# EAGLE design temp-stellwerk-laser-4-left (EAGLE 9.6.2)
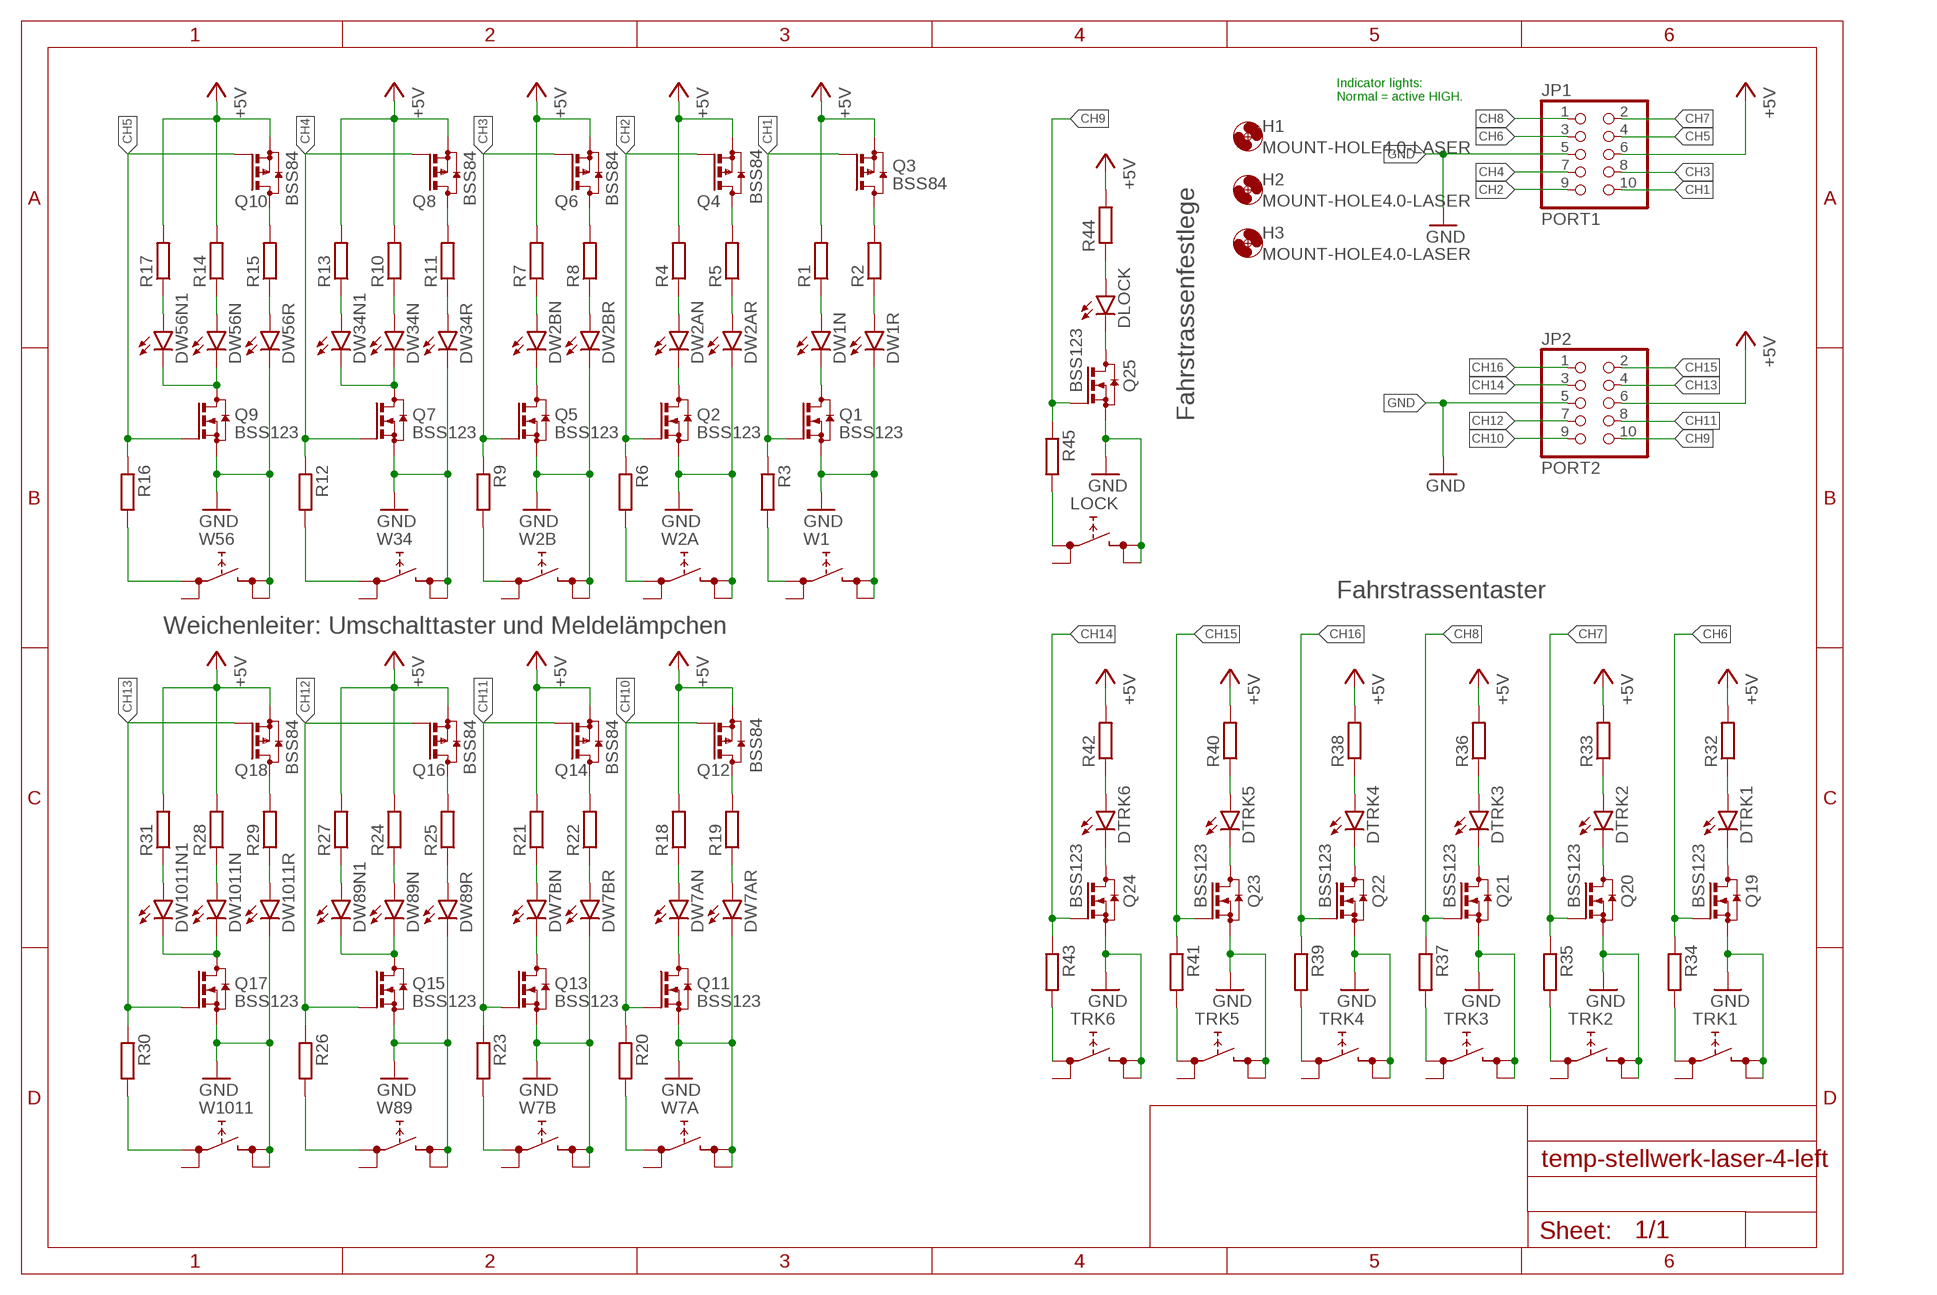
[diagram p0: schematic, sheet 1]

## Parts
DLOCK  LEDCHIPLED_0805  [CHIPLED_0805]
DTRK1  LEDCHIPLED_0805  [CHIPLED_0805]
DTRK2  LEDCHIPLED_0805  [CHIPLED_0805]
DTRK3  LEDCHIPLED_0805  [CHIPLED_0805]
DTRK4  LEDCHIPLED_0805  [CHIPLED_0805]
DTRK5  LEDCHIPLED_0805  [CHIPLED_0805]
DTRK6  LEDCHIPLED_0805  [CHIPLED_0805]
DW1N  LEDCHIPLED_0603  [CHIPLED_0603]
DW1R  LEDCHIPLED_0603  [CHIPLED_0603]
DW2AN  LEDCHIPLED_0603  [CHIPLED_0603]
DW2AR  LEDCHIPLED_0603  [CHIPLED_0603]
DW2BN  LEDCHIPLED_0805  [CHIPLED_0805]
DW2BR  LEDCHIPLED_0805  [CHIPLED_0805]
DW7AN  LEDCHIPLED_0603  [CHIPLED_0603]
DW7AR  LEDCHIPLED_0603  [CHIPLED_0603]
DW7BN  LEDCHIPLED_0805  [CHIPLED_0805]
DW7BR  LEDCHIPLED_0805  [CHIPLED_0805]
DW34N  LEDCHIPLED_0805  [CHIPLED_0805]
DW34N1  LEDCHIPLED_0805  [CHIPLED_0805]
DW34R  LEDCHIPLED_0805  [CHIPLED_0805]
DW56N  LEDCHIPLED_0805  [CHIPLED_0805]
DW56N1  LEDCHIPLED_0805  [CHIPLED_0805]
DW56R  LEDCHIPLED_0805  [CHIPLED_0805]
DW89N  LEDCHIPLED_0805  [CHIPLED_0805]
DW89N1  LEDCHIPLED_0805  [CHIPLED_0805]
DW89R  LEDCHIPLED_0805  [CHIPLED_0805]
DW1011N  LEDCHIPLED_0805  [CHIPLED_0805]
DW1011N1  LEDCHIPLED_0805  [CHIPLED_0805]
DW1011R  LEDCHIPLED_0805  [CHIPLED_0805]
H1  MOUNT-HOLE4.0-LASER  [MOUNT-HOLE-3.2-4.0-LASER]
H2  MOUNT-HOLE4.0-LASER  [MOUNT-HOLE-3.2-4.0-LASER]
H3  MOUNT-HOLE4.0-LASER  [MOUNT-HOLE-3.2-4.0-LASER]
JP1  PORT1  PINHD-2X5CN  [CON10M]
JP2  PORT2  PINHD-2X5CN  [CON10M]
LOCK  LOCK  TACTSW-6X6S  [TACTSW-6X6-LASER]
Q1  BSS123  [SOT23-NCH]
Q2  BSS123  [SOT23-NCH]
Q3  BSS84  [SOT23]
Q4  BSS84  [SOT23]
Q5  BSS123  [SOT23-NCH]
Q6  BSS84  [SOT23]
Q7  BSS123  [SOT23-NCH]
Q8  BSS84  [SOT23]
Q9  BSS123  [SOT23-NCH]
Q10  BSS84  [SOT23]
Q11  BSS123  [SOT23-NCH]
Q12  BSS84  [SOT23]
Q13  BSS123  [SOT23-NCH]
Q14  BSS84  [SOT23]
Q15  BSS123  [SOT23-NCH]
Q16  BSS84  [SOT23]
Q17  BSS123  [SOT23-NCH]
Q18  BSS84  [SOT23]
Q19  BSS123  [SOT23-NCH]
Q20  BSS123  [SOT23-NCH]
Q21  BSS123  [SOT23-NCH]
Q22  BSS123  [SOT23-NCH]
Q23  BSS123  [SOT23-NCH]
Q24  BSS123  [SOT23-NCH]
Q25  BSS123  [SOT23-NCH]
R1  R-EU_R0805  [R0805]
R2  R-EU_R0805  [R0805]
R3  R-EU_R0805  [R0805]
R4  R-EU_R0805  [R0805]
R5  R-EU_R0805  [R0805]
R6  R-EU_R0805  [R0805]
R7  R-EU_R0805  [R0805]
R8  R-EU_R0805  [R0805]
R9  R-EU_R0805  [R0805]
R10  R-EU_R0805  [R0805]
R11  R-EU_R0805  [R0805]
R12  R-EU_R0805  [R0805]
R13  R-EU_R0805  [R0805]
R14  R-EU_R0805  [R0805]
R15  R-EU_R0805  [R0805]
R16  R-EU_R0805  [R0805]
R17  R-EU_R0805  [R0805]
R18  R-EU_R0805  [R0805]
R19  R-EU_R0805  [R0805]
R20  R-EU_R0805  [R0805]
R21  R-EU_R0805  [R0805]
R22  R-EU_R0805  [R0805]
R23  R-EU_R0805  [R0805]
R24  R-EU_R0805  [R0805]
R25  R-EU_R0805  [R0805]
R26  R-EU_R0805  [R0805]
R27  R-EU_R0805  [R0805]
R28  R-EU_R0805  [R0805]
R29  R-EU_R0805  [R0805]
R30  R-EU_R0805  [R0805]
R31  R-EU_R0805  [R0805]
R32  R-EU_R0805  [R0805]
R33  R-EU_R0805  [R0805]
R34  R-EU_R0805  [R0805]
R35  R-EU_R0805  [R0805]
R36  R-EU_R0805  [R0805]
R37  R-EU_R0805  [R0805]
R38  R-EU_R0805  [R0805]
R39  R-EU_R0805  [R0805]
R40  R-EU_R0805  [R0805]
R41  R-EU_R0805  [R0805]
R42  R-EU_R0805  [R0805]
R43  R-EU_R0805  [R0805]
R44  R-EU_R0805  [R0805]
R45  R-EU_R0805  [R0805]
TRK1  TACTSW-6X6S  [TACTSW-6X6-LASER]
TRK2  TACTSW-6X6S  [TACTSW-6X6-LASER]
TRK3  TACTSW-6X6S  [TACTSW-6X6-LASER]
TRK4  TACTSW-6X6S  [TACTSW-6X6-LASER]
TRK5  TACTSW-6X6S  [TACTSW-6X6-LASER]
TRK6  TACTSW-6X6S  [TACTSW-6X6-LASER]
W1  W1  TACTSW-6X6S  [TACTSW-6X6-LASER]
W2A  TACTSW-6X6S  [TACTSW-6X6-LASER]
W2B  TACTSW-6X6S  [TACTSW-6X6-LASER]
W7A  TACTSW-6X6S  [TACTSW-6X6-LASER]
W7B  TACTSW-6X6S  [TACTSW-6X6-LASER]
W34  XOVER  TACTSW-6X6S  [TACTSW-6X6-LASER]
W56  XOVER  TACTSW-6X6S  [TACTSW-6X6-LASER]
W89  XOVER  TACTSW-6X6S  [TACTSW-6X6-LASER]
W1011  XOVER  TACTSW-6X6S  [TACTSW-6X6-LASER]

## Nets
+5V: JP1.6 JP2.6 Q3.2(S) Q4.2(S) Q6.2(S) Q8.2(S) Q10.2(S) Q12.2(S) Q14.2(S) Q16.2(S) Q18.2(S) R1.2 R4.2 R7.2 R10.2 R13.2 R14.2 R17.2 R18.2 R21.2 R24.2 R27.2 R28.2 R31.2 R32.2 R33.2 R36.2 R38.2 R40.2 R42.2 R44.2
CH1: JP1.10 Q1.1(G) Q3.1(G) R3.1
CH2: JP1.9 Q2.1(G) Q4.1(G) R6.1
CH3: JP1.8 Q5.1(G) Q6.1(G) R9.1
CH4: JP1.7 Q7.1(G) Q8.1(G) R12.1
CH5: JP1.4 Q9.1(G) Q10.1(G) R16.1
CH6: JP1.3 Q19.1(G) R34.1
CH7: JP1.2 Q20.1(G) R35.1
CH8: JP1.1 Q21.1(G) R37.1
CH9: JP2.10 Q25.1(G) R45.1
CH10: JP2.9 Q11.1(G) Q12.1(G) R20.1
CH11: JP2.8 Q13.1(G) Q14.1(G) R23.1
CH12: JP2.7 Q15.1(G) Q16.1(G) R26.1
CH13: JP2.4 Q17.1(G) Q18.1(G) R30.1
CH14: JP2.3 Q24.1(G) R43.1
CH15: JP2.2 Q23.1(G) R41.1
CH16: JP2.1 Q22.1(G) R39.1
GND: DW1R.C DW2AR.C DW2BR.C DW7AR.C DW7BR.C DW34R.C DW56R.C DW89R.C DW1011R.C JP1.5 JP2.5 LOCK.3(2.1) LOCK.4(2.2) Q1.2(S) Q2.2(S) Q5.2(S) Q7.2(S) Q9.2(S) Q11.2(S) Q13.2(S) Q15.2(S) Q17.2(S) Q19.2(S) Q20.2(S) Q21.2(S) Q22.2(S) Q23.2(S) Q24.2(S) Q25.2(S) TRK1.3(2.1) TRK1.4(2.2) TRK2.3(2.1) TRK2.4(2.2) TRK3.3(2.1) TRK3.4(2.2) TRK4.3(2.1) TRK4.4(2.2) TRK5.3(2.1) TRK5.4(2.2) TRK6.3(2.1) TRK6.4(2.2) W1.3(2.1) W1.4(2.2) W2A.3(2.1) W2A.4(2.2) W2B.3(2.1) W2B.4(2.2) W7A.3(2.1) W7A.4(2.2) W7B.3(2.1) W7B.4(2.2) W34.3(2.1) W34.4(2.2) W56.3(2.1) W56.4(2.2) W89.3(2.1) W89.4(2.2) W1011.3(2.1) W1011.4(2.2)
N$1: DTRK1.C Q19.3(D)
N$2: DW1N.C Q1.3(D)
N$3: DW1N.A R1.1
N$4: DW1R.A R2.1
N$5: Q3.3(D) R2.2
N$6: DW2AN.C Q2.3(D)
N$8: R3.2 W1.1(1.1)
N$9: DW2AN.A R4.1
N$10: DW2AR.A R5.1
N$11: Q4.3(D) R5.2
N$13: R6.2 W2A.1(1.1)
N$14: DW2BN.C Q5.3(D)
N$15: DW2BN.A R7.1
N$16: DW2BR.A R8.1
N$17: Q6.3(D) R8.2
N$19: R9.2 W2B.1(1.1)
N$20: DW56N.A R14.1
N$21: DW34N.A R10.1
N$22: DW34R.A R11.1
N$23: Q8.3(D) R11.2
N$25: R12.2 W34.1(1.1)
N$26: DW34N1.C DW34N.C Q7.3(D)
N$27: DW34N1.A R13.1
N$28: DW56R.A R15.1
N$29: Q10.3(D) R15.2
N$31: R16.2 W56.1(1.1)
N$32: DW56N1.C DW56N.C Q9.3(D)
N$33: DW56N1.A R17.1
N$34: DW7AN.C Q11.3(D)
N$35: DW7AN.A R18.1
N$36: DW7AR.A R19.1
N$37: Q12.3(D) R19.2
N$39: R20.2 W7A.1(1.1)
N$40: DW7BN.C Q13.3(D)
N$41: DW7BN.A R21.1
N$42: DW7BR.A R22.1
N$43: Q14.3(D) R22.2
N$45: R23.2 W7B.1(1.1)
N$46: DW89N.A R24.1
N$47: DW89R.A R25.1
N$48: Q16.3(D) R25.2
N$50: R26.2 W89.1(1.1)
N$51: DW89N1.C DW89N.C Q15.3(D)
N$52: DW89N1.A R27.1
N$53: DW1011N.A R28.1
N$54: DW1011R.A R29.1
N$55: Q18.3(D) R29.2
N$57: R30.2 W1011.1(1.1)
N$58: DW1011N1.C DW1011N.C Q17.3(D)
N$59: DW1011N1.A R31.1
N$60: DTRK1.A R32.1
N$61: DTRK2.C Q20.3(D)
N$62: DTRK2.A R33.1
N$64: R34.2 TRK1.1(1.1)
N$66: R35.2 TRK2.1(1.1)
N$67: DTRK3.C Q21.3(D)
N$68: DTRK3.A R36.1
N$70: R37.2 TRK3.1(1.1)
N$71: DTRK4.C Q22.3(D)
N$72: DTRK4.A R38.1
N$74: R39.2 TRK4.1(1.1)
N$75: DTRK5.C Q23.3(D)
N$76: DTRK5.A R40.1
N$78: R41.2 TRK5.1(1.1)
N$79: DTRK6.C Q24.3(D)
N$80: DTRK6.A R42.1
N$82: R43.2 TRK6.1(1.1)
N$83: DLOCK.C Q25.3(D)
N$84: DLOCK.A R44.1
N$86: LOCK.1(1.1) R45.2
Unconnected: LOCK.2(1.2) TRK1.2(1.2) TRK2.2(1.2) TRK3.2(1.2) TRK4.2(1.2) TRK5.2(1.2) TRK6.2(1.2) W1.2(1.2) W2A.2(1.2) W2B.2(1.2) W7A.2(1.2) W7B.2(1.2) W34.2(1.2) W56.2(1.2) W89.2(1.2) W1011.2(1.2)

## Notes on the sheet
- Indicator lights:
  Normal = active HIGH.
- Fahrstrassenfestlege
- Fahrstrassentaster
- Weichenleiter: Umschalttaster und Meldelämpchen

## Library data of the parts
DLOCK DTRK1-DTRK6 DW1N DW1R DW2AN DW2AR DW2BN DW2BR DW7AN DW7AR DW7BN DW7BR DW34N DW34N1 DW34R DW56N DW56N1 DW56R DW89N DW89N1 DW89R DW1011N DW1011N1 DW1011R = eagleparts:LED: LED OSRAM: - CHIPLED LG R971, LG N971, LY N971, LG Q971, LY Q971, LO R971, LY R971 LH N974, LH R974 LS Q976, LO Q976, LY Q976 LO Q996 - Hyper CHIPLED LW Q18S LB Q993, LB Q99A, LB R99A - SideLED LS A670, LO A670, LY A670, LG A670, LP A670 LB A673, LV A673, LT A673, LW A673 LH A674 LY A675 LS A676, LA A676, LO A676, LY A676, LW A676 LS A679, LY A679, LG A679 - Hyper Micro SIDELED® LS Y876, LA Y876, LO Y876, LY Y876 LT Y87S - SmartLED LW L88C, LW L88S LB L89C, LB L89S, LG L890 LS L89K, LO L89K, LY L89K LS L896, LA L896, LO L896, LY L896 - TOPLED LS T670, LO T670, LY T670, LG T670, LP T670 LSG T670, LSP T670, LSY T670, LOP T670, LYG T670 LG T671, LOG T671, LSG T671 LB T673, LV T673, LT T673, LW T673 LH T674 LS T676, LA T676, LO T676, LY T676, LB T676, LH T676, LSB T676, LW T676 LB T67C, LV T67C, LT T67C, LS T67K, LO T67K, LY T67K, LW E67C LS E67B, LA E67B, LO E67B, LY E67B, LB E67C, LV E67C, LT E67C LW T67C LS T679, LY T679, LG T679 LS T770, LO T770, LY T770, LG T770, LP T770 LB T773, LV T773, LT T773, LW T773 LH T774 LS E675, LA E675, LY E675, LS T675 LS T776, LA T776, LO T776, LY T776, LB T776 LHGB T686 LT T68C, LB T68C - Hyper Mini TOPLED® LB M676 - Mini TOPLED Santana® LG M470 LS M47K, LO M47K, LY M47K Source: http://www.osram.convergy.de LUXEON: - LUMILED® LXK2-PW12-R00, LXK2-PW12-S00, LXK2-PW14-U00, LXK2-PW14-V00 LXK2-PM12-R00, LXK2-PM12-S00, LXK2-PM14-U00 LXK2-PE12-Q00, LXK2-PE12-R00, LXK2-PE12-S00, LXK2-PE14-T00, LXK2-PE14-U00 LXK2-PB12-K00, LXK2-PB12-L00, LXK2-PB12-M00, LXK2-PB14-N00, LXK2-PB14-P00, LXK2-PB14-Q00 LXK2-PR12-L00, LXK2-PR12-M00, LXK2-PR14-Q00, LXK2-PR14-R00 LXK2-PD12-Q00, LXK2-PD12-R00, LXK2-PD12-S00 LXK2-PH12-R00, LXK2-PH12-S00 LXK2-PL12-P00, LXK2-PL12-Q00, LXK2-PL12-R00 Source: www.luxeon.com KINGBRIGHT: KA-3528ASYC Source: www.kingbright.com
H1-H3 = eagleparts:MOUNT-HOLE
JP1 JP2 = trainlib:PINHD-2X5: PIN HEADER
LOCK TRK1-TRK6 W1 W2A W2B W7A W7B W34 W56 W89 W1011 = eagleparts:TACTSW-6X6: 6.2 X 6.5mm TACT Switch (SMD) Source: http://www3.alps.co.jp/WebObjects/catalog.woa/PDF/E/Switch/Tact/SKHM/SKHM.PDF
Q1 Q2 Q5 Q7 Q9 Q11 Q13 Q15 Q17 Q19-Q25 = eagleparts:BSS123: N-CHANNEL MOS FET
Q3 Q4 Q6 Q8 Q10 Q12 Q14 Q16 Q18 = transistor-small-signal:BSS84: P-CHANNEL MOS FET
R1-R45 = rcl:R-EU_: RESISTOR, European symbol; SPICEPREFIX: R

## Net classes
0 default: width 0.254 mm, clearance 0.203 mm

## Board
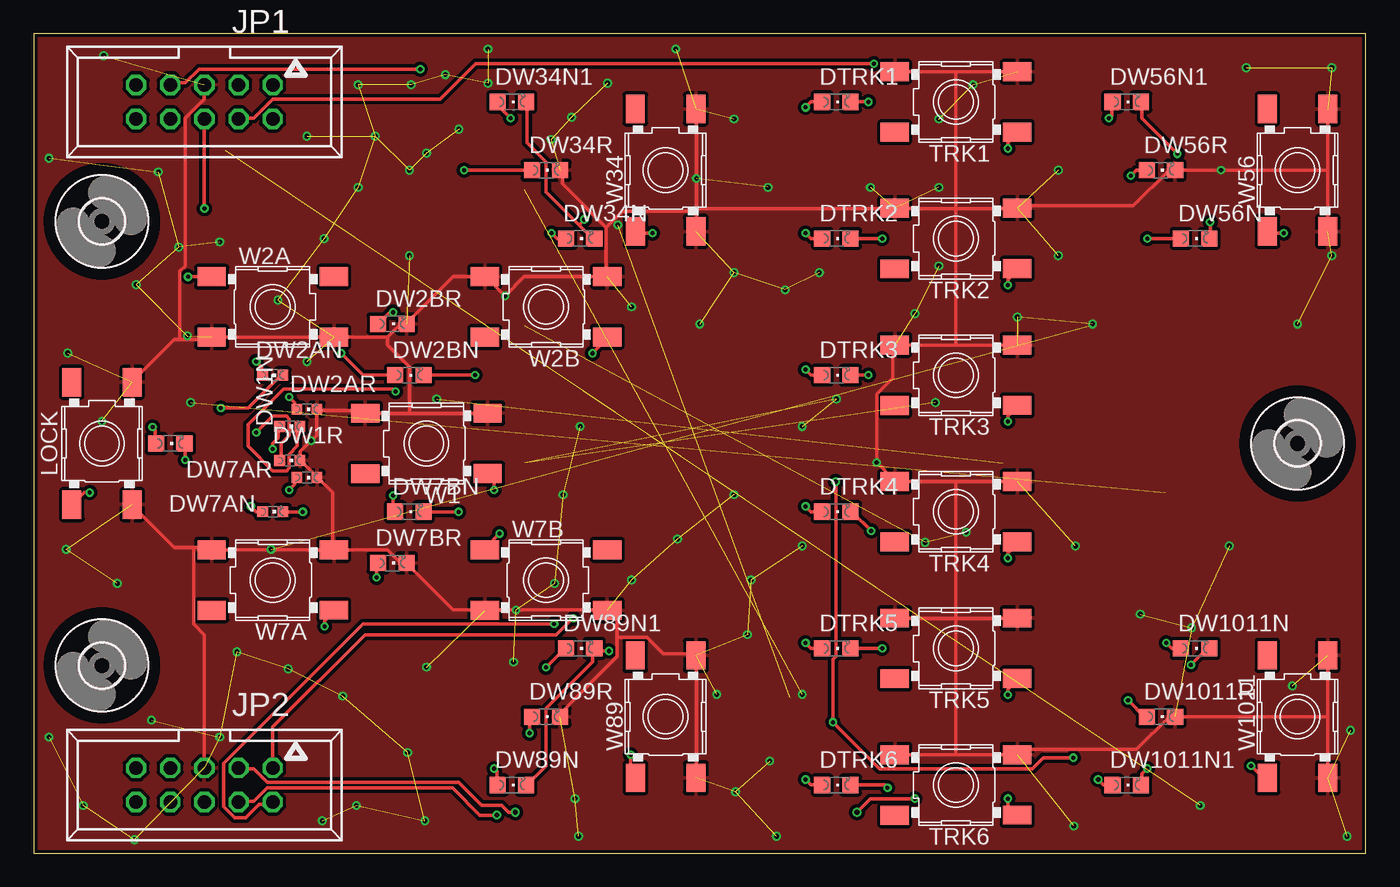
[diagram p1: board, top side]
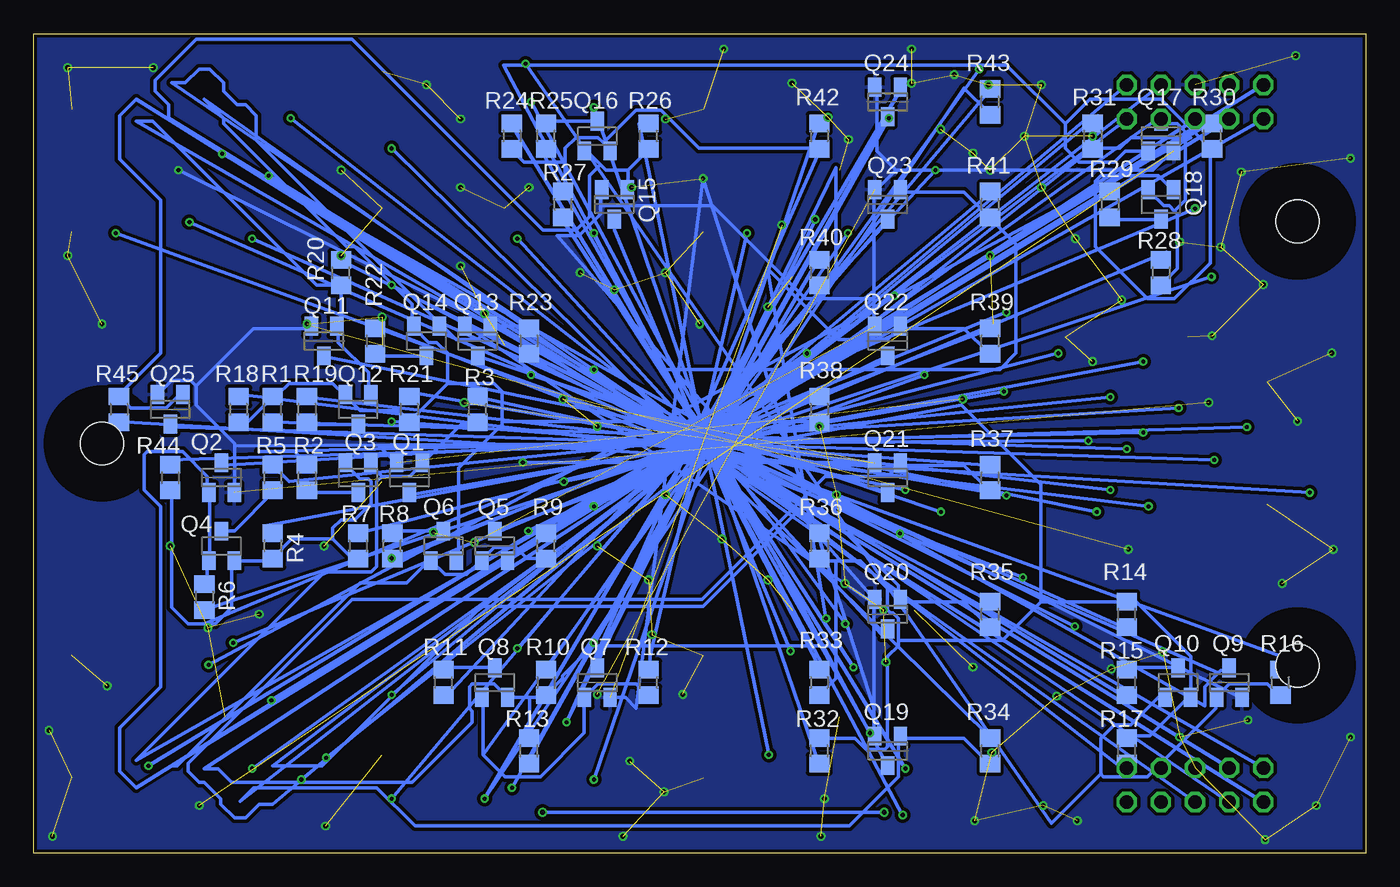
[diagram p2: board, bottom side, seen from below]

Size 99.06 x 60.96 mm. Coordinates in mm from the lower left corner, seen from the top.
Outline: 99.06,60.96 0,60.96 0,0 99.06,0 99.06,60.96
Copper layers (1*16): Top 0.035mm / dielectric 1.5mm / Bottom 0.035mm
Design rules "Fusion_eagle_rule_v1.1": minimum track width 6mil, minimum drill 12mil, track to track 6mil, track to pad 6mil, pad to pad 6mil, via to via 6mil, smd to smd 0mil, copper to edge 10mil, drill to drill 10mil, minimum pad ring 10mil, minimum via ring 6mil, stop-mask expansion 2mil, vias tented up to drill 100mil, thermal gap 10mil

### Footprints (pad centres in the part's own frame; a part is rotated, then mirrored left to right if it is on the bottom)
CHIPLED_0805 = smd 1.2 x 1.2: A 0,-1.05; C 0,1.05
CHIPLED_0603 = smd 0.8 x 0.8: A 0,-0.75; C 0,0.75
MOUNT-HOLE-3.2-4.0-LASER = hole 3.2: 0,0
CON10M = drill 1 octagon: 1 -5.08,-1.27; 2 -5.08,1.27; 3 -2.54,-1.27; 4 -2.54,1.27; 5 0,-1.27; 6 0,1.27; 7 2.54,-1.27; 8 2.54,1.27; 9 5.08,-1.27; 10 5.08,1.27
TACTSW-6X6-LASER = smd 2.1 x 1.4: 1 -4.55,2.24; 2 4.55,2.25; 3 -4.55,-2.25; 4 4.55,-2.25
SOT23-NCH = smd 1 x 1.4: 1 -0.95,-1.1; 2 0.95,-1.1; 3 0,1.1
SOT23 = smd 1 x 1.4: 1 -0.95,-1.1; 2 0.95,-1.1; 3 0,1.1
R0805 = smd 1.3 x 1.5: 1 -0.95,0; 2 0.95,0

### Placement (x,y rotation side)
DLOCK  10.16,30.48 270 top
DTRK1  59.69,55.88 270 top
DTRK2  59.69,45.72 270 top
DTRK3  59.69,35.56 270 top
DTRK4  59.69,25.4 270 top
DTRK5  59.69,15.24 270 top
DTRK6  59.69,5.08 270 top
DW1N  19.05,31.75 270 top
DW1R  19.05,29.21 270 top
DW2AN  17.78,35.56 270 top
DW2AR  20.32,33.02 270 top
DW2BN  27.94,35.56 270 top
DW2BR  26.67,39.37 270 top
DW7AN  17.78,25.4 270 top
DW7AR  20.32,27.94 270 top
DW7BN  27.94,25.4 270 top
DW7BR  26.67,21.59 270 top
DW34N  40.64,45.72 270 top
DW34N1  35.56,55.88 270 top
DW34R  38.1,50.8 270 top
DW56N  86.36,45.72 270 top
DW56N1  81.28,55.88 270 top
DW56R  83.82,50.8 270 top
DW89N  35.56,5.08 270 top
DW89N1  40.64,15.24 270 top
DW89R  38.1,10.16 270 top
DW1011N  86.36,15.24 270 top
DW1011N1  81.28,5.08 270 top
DW1011R  83.82,10.16 270 top
H1  5.08,13.97 180 top
H2  5.08,46.99 180 top
H3  93.98,30.48 180 top
JP1  12.7,55.88 180 top
JP2  12.7,5.08 180 top
LOCK  5.08,30.48 90 top
Q1  71.12,27.94 180 bottom
Q2  85.09,27.94 0 bottom
Q3  74.93,27.94 180 bottom
Q4  85.09,22.86 0 bottom
Q5  64.77,22.86 0 bottom
Q6  68.58,22.86 0 bottom
Q7  57.15,12.7 0 bottom
Q8  64.77,12.7 0 bottom
Q9  10.16,12.7 0 bottom
Q10  13.97,12.7 0 bottom
Q11  77.47,38.1 180 bottom
Q12  74.93,33.02 180 bottom
Q13  66.04,38.1 180 bottom
Q14  69.85,38.1 180 bottom
Q15  55.88,48.26 180 bottom
Q16  57.15,53.34 0 bottom
Q17  15.24,53.34 0 bottom
Q18  15.24,48.26 180 bottom
Q19  35.56,7.62 180 bottom
Q20  35.56,17.78 180 bottom
Q21  35.56,27.94 180 bottom
Q22  35.56,38.1 180 bottom
Q23  35.56,48.26 180 bottom
Q24  35.56,55.88 180 bottom
Q25  88.9,33.02 180 bottom
R1  81.28,33.02 90 bottom
R2  78.74,27.94 270 bottom
R3  66.04,33.02 90 bottom
R4  81.28,22.86 270 bottom
R5  81.28,27.94 270 bottom
R6  86.36,19.05 270 bottom
R7  74.93,22.86 270 bottom
R8  72.39,22.86 90 bottom
R9  60.96,22.86 90 bottom
R10  60.96,12.7 270 bottom
R11  68.58,12.7 90 bottom
R12  53.34,12.7 90 bottom
R13  62.23,7.62 90 bottom
R14  17.78,17.78 90 bottom
R15  17.78,12.7 90 bottom
R16  6.35,12.7 90 bottom
R17  17.78,7.62 90 bottom
R18  83.82,33.02 270 bottom
R19  78.74,33.02 270 bottom
R20  76.2,43.18 90 bottom
R21  71.12,33.02 270 bottom
R22  73.66,38.1 270 bottom
R23  62.23,38.1 270 bottom
R24  63.5,53.34 270 bottom
R25  60.96,53.34 90 bottom
R26  53.34,53.34 90 bottom
R27  59.69,48.26 90 bottom
R28  15.24,43.18 270 bottom
R29  19.05,48.26 270 bottom
R30  11.43,53.34 90 bottom
R31  20.32,53.34 270 bottom
R32  40.64,7.62 90 bottom
R33  40.64,12.7 270 bottom
R34  27.94,7.62 90 bottom
R35  27.94,17.78 90 bottom
R36  40.64,22.86 270 bottom
R37  27.94,27.94 90 bottom
R38  40.64,33.02 270 bottom
R39  27.94,38.1 90 bottom
R40  40.64,43.18 270 bottom
R41  27.94,48.26 90 bottom
R42  40.64,53.34 270 bottom
R43  27.94,55.88 90 bottom
R44  88.9,27.94 270 bottom
R45  92.71,33.02 270 bottom
TRK1  68.58,55.88 180 top
TRK2  68.58,45.72 180 top
TRK3  68.58,35.56 180 top
TRK4  68.58,25.4 180 top
TRK5  68.58,15.24 180 top
TRK6  68.58,5.08 180 top
W1  29.21,30.48 180 top
W2A  17.78,40.64 0 top
W2B  38.1,40.64 180 top
W7A  17.78,20.32 180 top
W7B  38.1,20.32 0 top
W34  46.99,50.8 90 top
W56  93.98,50.8 90 top
W89  46.99,10.16 90 top
W1011  93.98,10.16 90 top

### Tracks (layer width: path | path; a pad name or v marks a point on that pad's centre or on a via)
+5V  (via drill 0.3)
  Top 0.254: JP1.6 v12.7,47.95 | v77.32,7.11 75.08,7.11 74.27,6.3 62.89,6.3 v59.44,9.75 59.44,14.43 59.64,14.63 v59.64,27.64
  Bottom 0.254: R17.2 17.68,8.74 16.05,8.74 13.21,11.58 Q10.2 13.01,11.79 13.01,14.63 17.07,18.69 17.68,18.69 R14.2 17.88,18.69 24.18,18.69 | 34.75,15.85 34.75,17.48 35.15,17.88 35.36,17.88 35.56,18.09 35.56,19.71 37.59,21.74 39.42,21.74 | 34.75,15.85 34.75,15.44 35.56,14.63 35.56,7.92 35.76,7.72 37.19,7.72 38,8.53 40.64,8.53 R32.2 | 39.42,21.74 40.64,21.74 R36.2 | 39.42,21.74 39.42,15.44 | 39.42,15.44 39.42,13.01 40.64,11.79 R33.2 | 24.18,18.69 27.03,15.85 34.75,15.85 | 76.81,23.37 76.81,24.18 76.2,24.79 75.18,24.79 73.97,26.01 73.97,27.64 74.17,27.84 74.78,27.84 75.79,28.85 Q3.2 | 76.81,23.37 75.39,21.95 74.98,21.95 R7.2 | 86.36,17.07 85.55,17.07 84.33,18.29 84.33,21.74 Q4.2 84.12,21.74 81.28,21.74 R4.2 81.28,21.95 79.86,23.37 76.81,23.37 | 86.36,17.07 87.58,17.07 88.8,18.29 88.8,26.82 R44.2 | 62.18,11.58 60.96,11.58 R10.2 60.96,11.79 59.74,13.01 59.74,13.21 57.51,15.44 39.42,15.44 | 62.18,11.58 63.8,11.58 Q8.2 64.01,11.79 64.82,12.6 66.45,12.6 66.65,12.39 66.65,10.77 66.45,10.57 66.45,9.75 70.92,5.28 84.33,5.28 85.34,6.3 86.36,6.3 JP1.6 | 62.18,11.58 62.18,8.74 R13.2 | v12.7,47.95 86.36,17.07 | 14.22,47.75 14.02,47.55 14.02,43.48 15.24,42.27 R28.2 | 14.22,47.75 14.63,48.16 15.04,48.16 16.05,49.17 Q18.2 | 20.32,52.43 18.29,52.43 17.48,53.24 13.61,53.24 13.41,53.03 13.41,48.56 14.22,47.75 | R40.2 40.64,42.27 39.42,43.48 39.42,51 v59.44,9.75 40.64,52.22 R42.2 40.64,52.43 49.58,52.43 52.43,55.27 54.25,55.27 56.69,52.83 | 56.69,52.83 57.1,53.24 58.73,53.24 59.54,52.43 59.54,51.41 | 56.69,52.83 56.29,52.43 Q16.2 56.69,52.83 | 59.54,51.41 59.54,49.38 R27.2 | 59.54,51.41 62.59,51.41 63.4,52.22 R24.2
  Bottom 0.254: v77.32,7.11 20.32,52.43 | 20.32,52.43 R31.2 | R18.2 83.72,32.11 83.11,32.11 81.28,33.93 R1.2 81.28,34.14 80.87,34.14 80.06,34.95 76.81,34.95 76,34.14 Q12.2 75.79,33.93 74.78,32.92 71.93,32.92 71.12,32.11 | 64.21,32.11 64.21,34.34 64.82,34.95 68.28,34.95 | 64.21,32.11 64.21,31.9 67.46,28.65 67.46,21.95 Q6.2 | 71.12,32.11 68.28,34.95 | 71.12,32.11 R21.2 | 68.28,34.95 68.28,37.19 69.09,38 69.7,38 70.71,39.01 Q14.2 70.92,39.22 70.92,40.84 75.18,45.11 75.79,45.11 84.94,54.25 84.94,54.66 86.36,56.08 JP2.6 | 64.21,32.11 40.64,32.11 | 40.64,32.11 v59.64,27.64 30.07,33.33 24.18,27.43 24.18,18.69 | 40.64,32.11 R38.2
CH1
  Bottom 0.254: 73.15,28.04 71.12,28.04 70.31,28.85 Q1.1 70.1,29.06 67.26,31.9 66.04,31.9 R3.1 | 73.15,28.04 73.97,28.85 Q3.1 | JP1.10 91.44,6.91 77.42,20.93 73.97,20.93 73.56,21.34 73.56,27.64 73.15,28.04
CH2
  Bottom 0.254: R6.1 86.36,20.12 86.16,20.32 86.16,21.74 Q4.1 85.95,21.95 85.95,26.82 Q2.1 86.16,27.03 86.16,28.04 87.99,29.87 90.63,29.87 90.83,29.67 90.83,27.03 89.61,25.81 89.61,12.39 92.66,9.35 92.66,6.1 91.44,4.88 JP1.9
CH3
  Bottom 0.254: R9.1 60.96,21.95 62.38,21.95 63.2,22.76 64.82,22.76 65.63,21.95 Q5.1 65.84,21.74 66.85,20.73 68.48,20.73 69.49,21.74 Q6.1 69.7,21.74 71.32,20.12 74.78,20.12 88.39,6.5 88.8,6.5 JP1.8
CH4  (via drill 0.3)
  Top 0.254: v28.75,58.32 12.29,58.32 11.28,57.3 10.26,57.3 JP1.7
  Bottom 0.254: R12.1 53.44,11.79 54.25,12.6 57.1,12.6 57.91,11.79 Q7.1 58.12,11.58 58.12,8.94 61.37,5.69 64.01,5.69 65.63,7.32 | 65.63,7.32 65.63,11.58 Q8.1 | 65.63,7.32 v28.75,58.32
CH5  (via drill 0.3)
  Top 0.254: v62.48,58.73 32.87,58.73 30.23,56.08 17.78,56.08 16.36,54.66 15.34,54.66 JP1.4
  Bottom 0.254: R16.1 6.5,11.79 7.32,12.6 10.16,12.6 10.97,11.79 Q9.1 11.18,11.58 11.18,10.77 16.26,5.69 19.51,5.69 19.71,5.89 | 19.71,5.89 19.71,8.53 18.69,9.55 17.48,9.55 15.44,11.58 15.04,11.58 Q10.1 | v62.48,58.73 23.37,2.23 19.71,5.89
CH6
  Bottom 0.254: R34.1 28.04,6.71 29.87,8.53 34.54,8.53 Q19.1 34.75,8.53 34.75,5.69 38.41,2.03 70.71,2.03 73.56,4.88 82.7,4.88 83.72,3.86 JP1.3
CH7
  Bottom 0.254: R35.1 28.04,16.87 29.87,18.69 34.54,18.69 Q20.1 34.75,18.9 34.75,19.91 40.44,25.6 42.06,25.6 49.3,18.36 65.76,18.36 77.62,6.5 81.28,6.5 JP1.2
CH8
  Bottom 0.254: R37.1 28.04,27.03 29.87,28.85 34.54,28.85 Q21.1 34.75,28.85 35.56,28.04 40.23,28.04 49.38,18.9 75.39,18.9 87.58,6.71 87.58,6.1 86.77,5.28 86.36,5.28 85.14,4.06 85.14,3.66 84.12,2.64 83.31,2.64 82.3,3.66 81.28,3.66 JP1.1
CH9
  Bottom 0.254: Q25.1 87.99,33.93 88.39,33.93 89.2,33.12 91.85,33.12 92.66,33.93 R45.1 92.66,34.14 89.61,37.19 89.61,48.56 92.66,51.61 92.66,54.86 91.44,56.08 JP2.10
CH10
  Bottom 0.254: Q12.1 74.17,34.14 74.17,35.76 76.4,38 76.4,39.01 Q11.1 76.4,39.22 76.2,39.42 R20.1 76.2,42.27 78.03,42.27 90.22,54.46 91.44,54.46 JP2.9
CH11
  Bottom 0.254: R23.1 62.38,39.22 65.02,39.22 Q13.1 65.23,39.01 66.04,38.2 67.67,38.2 68.48,39.01 68.89,39.01 Q14.1 69.09,39.22 69.09,39.62 82.5,53.03 82.5,54.86 83.31,55.68 83.92,55.68 84.94,56.69 84.94,57.3 85.95,58.32 86.77,58.32 87.78,57.3 88.8,57.3 JP2.8
CH12
  Bottom 0.254: 54.86,50.8 54.86,49.38 Q15.1 | 54.86,50.8 53.44,52.22 R26.1 | 56.9,51.21 56.49,50.8 54.86,50.8 | 56.9,51.21 57.91,52.22 Q16.1 | 56.9,51.21 57.71,50.39 57.71,47.35 58.73,46.33 61.16,46.33 75.39,60.55 86.97,60.55 90.02,57.51 90.02,56.69 89,55.68 89,54.66 JP2.7
CH13  (via drill 0.3)
  Top 0.254: v34.44,2.85 33.17,2.85 31.14,4.88 17.37,4.88 16.36,3.86 15.34,3.86 JP2.4
  Bottom 0.254: Q18.1 14.43,49.38 15.44,50.39 19.71,50.39 20.12,49.99 20.12,45.11 16.26,41.25 14.22,41.25 11.58,43.89 11.58,52.22 R30.1 11.58,52.43 15.24,56.08 20.52,56.08 22.35,54.25 | 22.35,54.25 22.35,52.43 21.34,51.41 18.69,51.41 17.88,52.22 16.26,52.22 Q17.1 | v34.44,2.85 64.11,58.62 26.72,58.62 22.35,54.25
CH14  (via drill 0.3, 0.35)
  Top 0.254: v65.53,4.06 62.23,4.06 v61.21,3.05 | JP2.3 15.34,6.3 16.36,6.3 17.37,5.28 31.6,5.28 33.07,3.81 33.3,3.56 34.8,3.56 35.31,3.05 v35.81,3.05
  Bottom 0.254: Q24.1 34.54,56.9 v65.53,4.06 29.87,56.9 28.04,55.07 R43.1 | v35.81,3.05 v61.21,3.05
CH15  (via drill 0.3)
  Top 0.254: v38.71,17.07 24.49,17.07 14.12,6.71 14.12,3.45 14.94,2.64 15.75,2.64 16.76,3.66 17.78,3.66 JP2.2
  Bottom 0.254: Q23.1 34.54,49.17 29.87,49.17 28.04,47.35 R41.1 27.84,47.14 26.01,45.31 26.01,37.19 27.23,35.97 52.43,35.97 v38.71,17.07
CH16  (via drill 0.3)
  Top 0.254: 17.78,6.5 JP2.1 17.78,9.4 24.64,16.26 38.86,16.26 40.08,17.48 v40.13,17.48
  Bottom 0.254: R39.1 28.04,37.19 29.87,39.01 34.54,39.01 Q22.1 34.75,39.01 35.56,38.2 39.22,38.2 44.5,43.48 v40.13,17.48
GND  (via drill 0.3, 0.35)  (99 unrouted)
  Top 0.254: 96.22,10.16 96.22,5.69 W1011.3 | 96.22,10.16 96.22,14.63 W1011.4 | 68.58,17.48 64.11,17.48 TRK5.4 | 68.58,17.48 73.05,17.48 TRK5.3 | 68.58,7.32 73.05,7.32 TRK6.3 73.25,7.52 73.46,7.72 81.99,7.72 84.43,10.16 DW1011R.C 96.22,10.16 | 68.58,7.32 64.11,7.32 TRK6.4 | 68.58,7.32 68.58,17.48 | 68.58,37.8 64.11,37.8 TRK3.4 63.91,37.8 63.91,35.36 62.69,34.14 v62.69,29.06 63.91,27.84 TRK4.4 64.11,27.64 68.58,27.64 | 68.58,37.8 73.05,37.8 TRK3.3 | 68.58,27.64 73.05,27.64 TRK4.3 | 96.22,50.8 96.22,46.33 W56.3 | 96.22,50.8 96.22,55.27 W56.4 | 68.58,58.12 64.11,58.12 TRK1.4 | 68.58,58.12 73.05,58.12 TRK1.3 | 68.58,47.95 73.05,47.95 TRK2.3 73.25,48.16 81.79,48.16 84.43,50.8 DW56R.C v88.29,50.8 96.22,50.8 | 68.58,47.95 64.11,47.95 TRK2.4 63.91,47.95 49.28,47.95 | 68.58,47.95 68.58,58.12 | 68.58,47.95 68.58,37.8 | 68.58,27.64 68.58,17.48 | 10.87,38.2 10.46,38.2 7.42,35.15 LOCK.4 | 10.87,38.2 13.11,38.2 W2A.3 13.31,38.41 22.25,38.41 W2A.4 22.45,38.41 26.31,38.41 | JP1.5 12.7,56.08 11.28,54.66 11.28,43.69 10.87,43.28 10.87,38.2 | 11.89,22.76 10.46,22.76 7.42,25.81 LOCK.3 | 11.89,22.76 13.11,22.76 W7A.4 13.31,22.55 22.25,22.55 W7A.3 | JP2.5 12.7,16.26 11.89,17.07 11.89,22.76 | 43.38,16.05 43.38,17.27 42.77,17.88 W7B.4 42.57,18.09 v35.87,18.09 33.63,18.09 W7B.3 33.43,18.09 31.19,18.09 27.74,21.54 DW7BR.C 27.53,21.74 27.13,21.74 26.31,22.55 22.45,22.55 W7A.3 | 43.38,16.05 43.38,14.63 39.32,10.57 39.32,10.16 DW89R.C | 43.38,16.05 45.62,16.05 46.84,14.83 49.07,14.83 W89.4 49.28,14.63 49.28,5.69 W89.3 | 49.28,47.75 49.28,46.33 W34.3 | 49.28,47.75 49.28,47.95 | 49.28,47.95 v49.28,50.19 49.28,55.27 W34.4
  Top 0.254: 42.57,46.53 39.32,49.78 39.32,50.8 DW34R.C | 42.57,46.53 42.57,43.08 W2B.3 42.57,42.88 36.47,42.88 v35.05,41.45 33.63,42.88 W2B.4 33.43,42.88 31.19,42.88 27.74,39.42 DW2BR.C 27.53,39.22 27.13,39.22 26.31,38.41 | 49.28,47.75 43.79,47.75 42.57,46.53 | 19.81,29.26 21.03,28.04 DW7AR.C 21.23,27.84 22.25,26.82 22.25,22.76 W7A.3 | 19.81,29.26 19.81,29.87 v20.62,30.68 21.03,31.09 21.03,32.92 DW2AR.C 21.23,32.92 24.49,32.92 W1.4 24.69,32.72 27.94,32.72 | 19.81,29.26 DW1R.C | 27.94,32.72 33.63,32.72 W1.3 | 26.31,38.41 26.31,37.8 27.94,36.17 27.94,32.72
  Bottom 0.254: v62.69,29.06 36.37,29.06 Q21.2 | v88.29,50.8 9.35,11.58 Q9.2 | 56.9,48.16 56.9,49.17 Q15.2 | 56.9,48.16 56.9,47.55 58.52,45.92 60.15,45.92 v35.87,18.09 66.85,39.22 Q13.2 | 36.58,41.25 36.58,49.17 Q23.2 36.37,49.38 34.95,50.8 | 36.58,41.25 36.58,39.22 Q22.2 | 34.95,50.8 15.85,50.8 14.43,52.22 Q17.2 | 34.95,50.8 36.37,52.22 36.37,56.9 Q24.2 | 56.9,48.16 48.56,48.16 41.66,41.25 36.58,41.25 | 84.12,30.28 84.12,30.48 86.97,33.33 86.97,34.75 | 84.12,30.28 84.12,27.03 Q2.2 | 86.97,34.75 87.38,35.15 88.8,35.15 89.81,34.14 Q25.2 | 84.12,30.28 v20.62,30.68 73.36,30.28 72.14,29.06 Q1.2 | 86.97,34.75 82.7,39.01 78.44,39.01 Q11.2 | 36.58,10.77 36.58,18.69 Q20.2 | 36.58,10.77 36.58,8.74 Q19.2 | 36.58,10.77 v49.28,50.19 54.25,10.77 55.07,11.58 56.08,11.58 Q7.2 | v35.05,41.45 64.01,21.74 Q5.2
  other vias: 88.9,22.86 77.47,22.86 78.74,39.37 93.98,39.37 76.2,44.45 76.2,50.8 67.31,49.53 90.17,58.42 96.52,58.42 96.52,44.45 67.31,54.61 69.85,57.15 62.23,49.53 54.61,49.53 52.07,54.61 55.88,41.91 52.07,43.18 58.42,43.18 49.53,39.37 44.45,40.64 27.94,44.45 21.59,45.72 24.13,49.53 20.32,53.34 25.4,53.34 27.94,50.8 29.21,52.07 31.62,53.85 24.13,57.15 28.07,57.15 30.61,57.91 33.78,57.28 33.78,59.82 47.75,59.82 42.67,57.28 40.01,54.74 38.48,53.09 40.64,31.75 57.15,31.75 57.15,22.86 53.34,20.32 44.45,20.32 47.88,23.37 39.37,26.67 52.07,26.67 38.73,20.07 29.21,13.84 35.69,14.22 22.99,11.68 27.81,7.49 29.08,2.41 21.46,2.41 24,3.56 18.92,13.72 13.84,8.64 15.11,14.99 8.76,9.91 3.68,3.56 7.49,1.02 1.14,8.64 6.22,20.07 2.41,22.61 17.65,22.61 13.84,45.47 18.16,41.15 10.79,45.09 9.27,50.67 11.68,33.53 11.43,38.48 2.54,37.21 7.62,42.29 5.08,32.13 57.15,11.81 50.8,11.81 53.09,16.26 54.74,6.86 52.2,4.57 40.26,4.06 40.51,1.27 55.24,1.27 77.34,2.03 86.74,3.56 97.92,9.14 93.6,12.45 97.66,1.27 5.21,59.31 1.14,51.69 73.15,39.88 65.53,40.13 67.06,33.53 59.69,33.78 66.29,23.11 69.34,23.88 29.97,33.78 20.32,36.58 67.31,43.69 43.43,46.74 82.3,17.78 86.11,16.76
  pour Top (isolate 0.254): 99.06,0 0,0 0,60.96 99.06,60.96
  pour Bottom (isolate 0.254): 0,60.96 99.06,60.96 99.06,0 0,0
N$1  (via drill 0.3)
  Top 0.254: v62.08,55.88 DTRK1.C
  Bottom 0.254: v62.08,55.88 35.56,6.5 Q19.3
N$2  (via drill 0.3)
  Top 0.254: v26.92,34.34 26.72,34.54 18.59,34.54 15.95,31.9 15.95,30.28 17.78,28.45 18.8,28.45 19,28.65 19,29.67 19.61,30.28 19.61,31.7 DW1N.C
  Bottom 0.254: v26.92,34.34 71.32,26.62 71.12,26.82 Q1.3
N$3  (via drill 0.3)
  Top 0.254: v17.78,30.07 17.78,30.48 18.19,30.89 18.19,31.7 DW1N.A
  Bottom 0.254: R1.1 v17.78,30.07
N$4  (via drill 0.3)
  Top 0.254: v16.56,31.29 17.78,32.51 18.8,32.51 19,32.31 19,31.09 18.39,30.48 18.39,29.26 DW1R.A
  Bottom 0.254: v16.56,31.29 82.3,29.87 79.65,29.87 78.84,29.06 R2.1
N$5
  Bottom 0.254: Q3.3 74.98,26.82 78.64,26.82 R2.2
N$6  (via drill 0.3)
  Top 0.254: v13.92,33.12 15.95,33.12 18.39,35.56 DW2AN.C
  Bottom 0.254: v13.92,33.12 85.14,28.85 Q2.3
N$8  (via drill 0.3)
  Top 0.254: v34.24,27.03 34.24,27.64 33.83,28.04 W1.1
  Bottom 0.254: v34.24,27.03 66.04,33.93 R3.2
N$9  (via drill 0.3)
  Top 0.254: v16.56,36.58 16.97,36.17 16.97,35.56 DW2AN.A
  Bottom 0.254: v16.56,36.58 81.69,24.38 81.28,23.98 R4.1
N$10  (via drill 0.3)
  Top 0.254: v19,33.93 19.41,33.53 19.41,33.12 DW2AR.A
  Bottom 0.254: v19,33.93 80.06,27.64 81.28,28.85 R5.1
N$11
  Bottom 0.254: Q4.3 84.94,23.98 84.12,23.98 81.28,26.82 R5.2
N$13  (via drill 0.3)
  Top 0.254: v11.48,42.88 13.11,42.88 W2A.1
  Bottom 0.254: v11.48,42.88 86.36,18.09 R6.2
N$14  (via drill 0.3)
  Top 0.254: v32.82,35.56 DW2BN.C
  Bottom 0.254: v32.82,35.56 64.82,23.98 Q5.3
N$15  (via drill 0.3)
  Top 0.254: DW2BN.A 24.49,35.56 v22.86,37.19
  Bottom 0.254: v22.86,37.19 74.98,23.77 R7.1
N$16  (via drill 0.3)
  Top 0.254: v26.72,40.23 26.52,40.23 25.7,39.42 DW2BR.A
  Bottom 0.254: v26.72,40.23 72.34,21.74 R8.1
N$17
  Bottom 0.254: Q6.3 68.68,23.98 72.34,23.98 R8.2
N$19  (via drill 0.3)
  Top 0.254: v41.55,37.19 42.57,38.2 W2B.1
  Bottom 0.254: v41.55,37.19 60.96,23.77 R9.2
N$20  (via drill 0.3)
  Top 0.254: v82.8,45.72 DW56N.A
  Bottom 0.254: v82.8,45.72 17.68,16.66 R14.1
N$21  (via drill 0.3)
  Top 0.254: DW34N.A 38.91,45.72 v38.51,46.13
  Bottom 0.254: v38.51,46.13 60.55,14.22 60.96,13.82 R10.1
N$22  (via drill 0.3)
  Top 0.254: v32,50.8 DW34R.A
  Bottom 0.254: v32,50.8 68.48,11.58 R11.1
N$23
  Bottom 0.254: Q8.3 64.82,13.82 68.48,13.82 R11.2
N$25  (via drill 0.3)
  Top 0.254: v46.02,46.13 44.81,46.13 W34.1
  Bottom 0.254: v46.02,46.13 53.24,14.63 53.24,13.82 R12.2
N$26  (via drill 0.3)
  Top 0.254: 40.54,46.74 41.55,45.72 DW34N.C | 40.54,46.74 38.1,49.17 38.1,51.41 36.68,52.83 36.68,55.88 DW34N1.C | 40.54,46.74 v40.95,47.14
  Bottom 0.254: v40.95,47.14 57.3,13.82 Q7.3
N$27  (via drill 0.3)
  Top 0.254: v35.46,54.66 34.65,55.47 34.65,55.88 DW34N1.A
  Bottom 0.254: v35.46,54.66 62.59,6.3 62.38,6.5 R13.1
N$28  (via drill 0.3)
  Top 0.254: DW56R.A 81.99,50.8 v81.58,50.39
  Bottom 0.254: v81.58,50.39 17.48,11.38 17.68,11.58 R15.1
N$29
  Bottom 0.254: Q10.3 14.02,13.82 17.68,13.82 R15.2
N$31  (via drill 0.3)
  Top 0.254: v92.96,46.13 91.75,46.13 W56.1
  Bottom 0.254: v92.96,46.13 6.3,14.63 6.3,13.82 R16.2
N$32  (via drill 0.3)
  Top 0.254: v85.04,52.02 82.4,54.66 82.4,55.88 DW56N1.C | v87.48,46.94 87.48,45.72 DW56N.C
  Bottom 0.254: v85.04,52.02 11.99,10.97 11.99,12.39 10.97,13.41 | 10.97,13.41 10.77,13.61 10.16,13.61 Q9.3 | 10.97,13.41 v87.48,46.94
N$33  (via drill 0.3)
  Top 0.254: v79.96,54.66 80.16,54.86 80.16,55.88 DW56N1.A
  Bottom 0.254: v79.96,54.66 18.09,6.3 17.88,6.5 R17.1
N$34  (via drill 0.3)
  Top 0.254: v20.02,25.4 DW7AN.C
  Bottom 0.254: v20.02,25.4 77.62,36.98 Q11.3
N$35  (via drill 0.3)
  Top 0.254: DW7AN.A 16.56,25.4 v16.15,25.81
  Bottom 0.254: v16.15,25.81 83.92,34.14 R18.1
N$36  (via drill 0.3)
  Top 0.254: v19,27.03 19.41,27.43 19.41,27.84 DW7AR.A
  Bottom 0.254: v19,27.03 78.84,33.93 R19.1
N$37
  Bottom 0.254: Q12.3 74.98,31.9 78.64,31.9 R19.2
N$39  (via drill 0.3)
  Top 0.254: v21.64,16.87 21.64,17.27 22.25,17.88 W7A.1
  Bottom 0.254: v21.64,16.87 76.2,44.09 R20.2
N$40  (via drill 0.3)
  Top 0.254: v31.6,25.4 DW7BN.C
  Bottom 0.254: v31.6,25.4 66.04,36.98 Q13.3
N$41  (via drill 0.3)
  Top 0.254: v26.72,26.62 26.72,25.4 DW7BN.A
  Bottom 0.254: v26.72,26.62 71.32,34.34 71.12,34.14 R21.1
N$42  (via drill 0.3)
  Top 0.254: v25.5,20.52 25.5,21.54 DW7BR.A
  Bottom 0.254: v25.5,20.52 73.56,39.22 R22.1
N$43
  Bottom 0.254: Q14.3 69.9,36.98 73.56,36.98 R22.2
N$45  (via drill 0.3)
  Top 0.254: v34.65,23.77 33.63,22.76 W7B.1
  Bottom 0.254: v34.65,23.77 62.38,37.19 R23.2
N$46  (via drill 0.3)
  Top 0.254: v34.24,6.3 34.44,6.1 34.44,5.08 DW89N.A
  Bottom 0.254: v34.24,6.3 63.8,54.66 63.6,54.46 R24.1
N$47  (via drill 0.3)
  Top 0.254: v36.88,8.94 36.88,10.16 DW89R.A
  Bottom 0.254: v36.88,8.94 61.16,52.02 60.96,52.22 R25.1
N$48
  Bottom 0.254: Q16.3 57.3,54.46 60.96,54.46 R25.2
N$50  (via drill 0.3)
  Top 0.254: v44.4,7.32 44.4,5.89 44.6,5.69 W89.1
  Bottom 0.254: v44.4,7.32 54.05,54.25 53.44,54.25 R26.2
N$51  (via drill 0.3)
  Top 0.254: 41.55,15.04 41.55,14.22 38.1,10.77 38.1,6.5 36.68,5.08 DW89N.C | 41.55,15.04 41.55,15.24 DW89N1.C 41.55,15.04 | 41.55,15.04 v42.77,15.04
  Bottom 0.254: Q15.3 55.88,46.33 v42.77,15.04
N$52  (via drill 0.3)
  Top 0.254: v38.1,13.82 39.52,15.24 DW89N1.A
  Bottom 0.254: v38.1,13.82 59.74,47.14 R27.1
N$53  (via drill 0.3)
  Top 0.254: DW1011N.A 84.63,15.24 v84.23,15.65
  Bottom 0.254: v84.23,15.65 14.83,44.7 15.24,44.3 R28.1
N$54  (via drill 0.3)
  Top 0.254: v81.38,11.38 82.6,10.16 DW1011R.A
  Bottom 0.254: v81.38,11.38 18.69,49.58 18.9,49.38 R29.1
N$55
  Bottom 0.254: Q18.3 15.24,47.14 18.9,47.14 R29.2
N$57  (via drill 0.3)
  Top 0.254: v90.53,6.5 91.54,5.49 W1011.1
  Bottom 0.254: v90.53,6.5 11.38,54.46 R30.2
N$58  (via drill 0.3)
  Top 0.254: v86.06,14.02 87.27,15.24 DW1011N.C | v82.8,6.3 82.4,5.89 82.4,5.08 DW1011N1.C
  Bottom 0.254: v86.06,14.02 13.01,53.24 14.02,54.25 15.24,54.25 Q17.3 15.24,54.46 15.44,54.66 v82.8,6.3
N$59  (via drill 0.3)
  Top 0.254: DW1011N1.A 79.55,5.08 v79.15,5.49
  Bottom 0.254: v79.15,5.49 19.91,54.86 20.32,54.46 R31.1
N$60  (via drill 0.3)
  Top 0.254: DTRK1.A 57.81,55.88 v57.4,55.47
  Bottom 0.254: v57.4,55.47 40.64,6.5 R32.1
N$61  (via drill 0.3)
  Top 0.254: v63.09,45.72 DTRK2.C
  Bottom 0.254: v63.09,45.72 35.97,16.26 35.56,16.66 Q20.3
N$62  (via drill 0.3)
  Top 0.254: DTRK2.A 57.81,45.72 v57.4,46.13
  Bottom 0.254: v57.4,46.13 40.64,13.82 R33.1
N$64  (via drill 0.3)
  Top 0.254: v72.44,52.43 72.44,52.83 73.05,53.44 TRK1.1
  Bottom 0.254: v72.44,52.43 27.84,8.53 R34.2
N$66  (via drill 0.3)
  Top 0.254: v72.44,42.27 72.44,42.67 73.05,43.28 TRK2.1
  Bottom 0.254: v72.44,42.27 27.84,18.69 R35.2
N$67  (via drill 0.3)
  Top 0.254: v62.08,35.56 DTRK3.C
  Bottom 0.254: v62.08,35.56 35.56,26.82 Q21.3
N$68  (via drill 0.3)
  Top 0.254: DTRK3.A 57.81,35.56 v57.4,35.97
  Bottom 0.254: v57.4,35.97 40.64,23.98 R36.1
N$70  (via drill 0.3)
  Top 0.254: v72.44,32.11 72.44,32.51 73.05,33.12 TRK3.1
  Bottom 0.254: v72.44,32.11 27.84,28.85 R37.2
N$71  (via drill 0.3)
  Top 0.254: v62.28,23.98 60.86,25.4 DTRK4.C
  Bottom 0.254: v62.28,23.98 35.56,36.98 Q22.3
N$72  (via drill 0.3)
  Top 0.254: DTRK4.A 57.81,25.4 v57.4,25.81
  Bottom 0.254: v57.4,25.81 40.64,34.14 R38.1
N$74  (via drill 0.3)
  Top 0.254: v72.44,21.95 72.44,22.35 73.05,22.96 TRK4.1
  Bottom 0.254: v72.44,21.95 27.84,39.01 R39.2
N$75  (via drill 0.3)
  Top 0.254: v63.09,15.24 DTRK5.C
  Bottom 0.254: v63.09,15.24 35.97,46.74 35.56,47.14 Q23.3
N$76  (via drill 0.3)
  Top 0.254: DTRK5.A 57.81,15.24 v57.4,15.65
  Bottom 0.254: v57.4,15.65 40.64,44.3 R40.1
N$78  (via drill 0.3)
  Top 0.254: v72.44,11.79 72.44,12.19 73.05,12.8 TRK5.1
  Bottom 0.254: v72.44,11.79 27.84,49.17 R41.2
N$79  (via drill 0.3)
  Top 0.254: DTRK6.C 63.3,5.08 v63.5,4.88
  Bottom 0.254: Q24.3 v63.5,4.88
N$80  (via drill 0.3)
  Top 0.254: DTRK6.A 57.81,5.08 v57.4,5.49
  Bottom 0.254: v57.4,5.49 40.64,54.46 R42.1
N$82  (via drill 0.3)
  Top 0.254: v72.44,4.06 72.44,3.45 73.05,2.85 TRK6.1
  Bottom 0.254: v72.44,4.06 27.84,56.9 R43.2
N$83  (via drill 0.3)
  Top 0.254: v11.28,29.26 11.28,30.48 DLOCK.C
  Bottom 0.254: v11.28,29.26 88.59,31.7 88.8,31.9 Q25.3
N$84  (via drill 0.3)
  Top 0.254: v8.84,31.7 9.04,31.5 9.04,30.48 DLOCK.A
  Bottom 0.254: v8.84,31.7 89.2,29.26 89,29.06 R44.1
N$86  (via drill 0.3)
  Top 0.254: v4.17,26.82 3.76,26.82 2.95,26.01 LOCK.1
  Bottom 0.254: v4.17,26.82 92.86,32.11 R45.2

### Text on the board
laser-etch: Fdl | Gl.1 | (3/4) | (5/6) | Gl.2 | (2a) | (2b) | Gl.3 | Fstr- | (1) | festl. | Gl.4 | (7a) | (7b) | Gl.5 | (8/9) | (10/11) | Gl.6